# EAGLE design main (EAGLE 9.3.0)
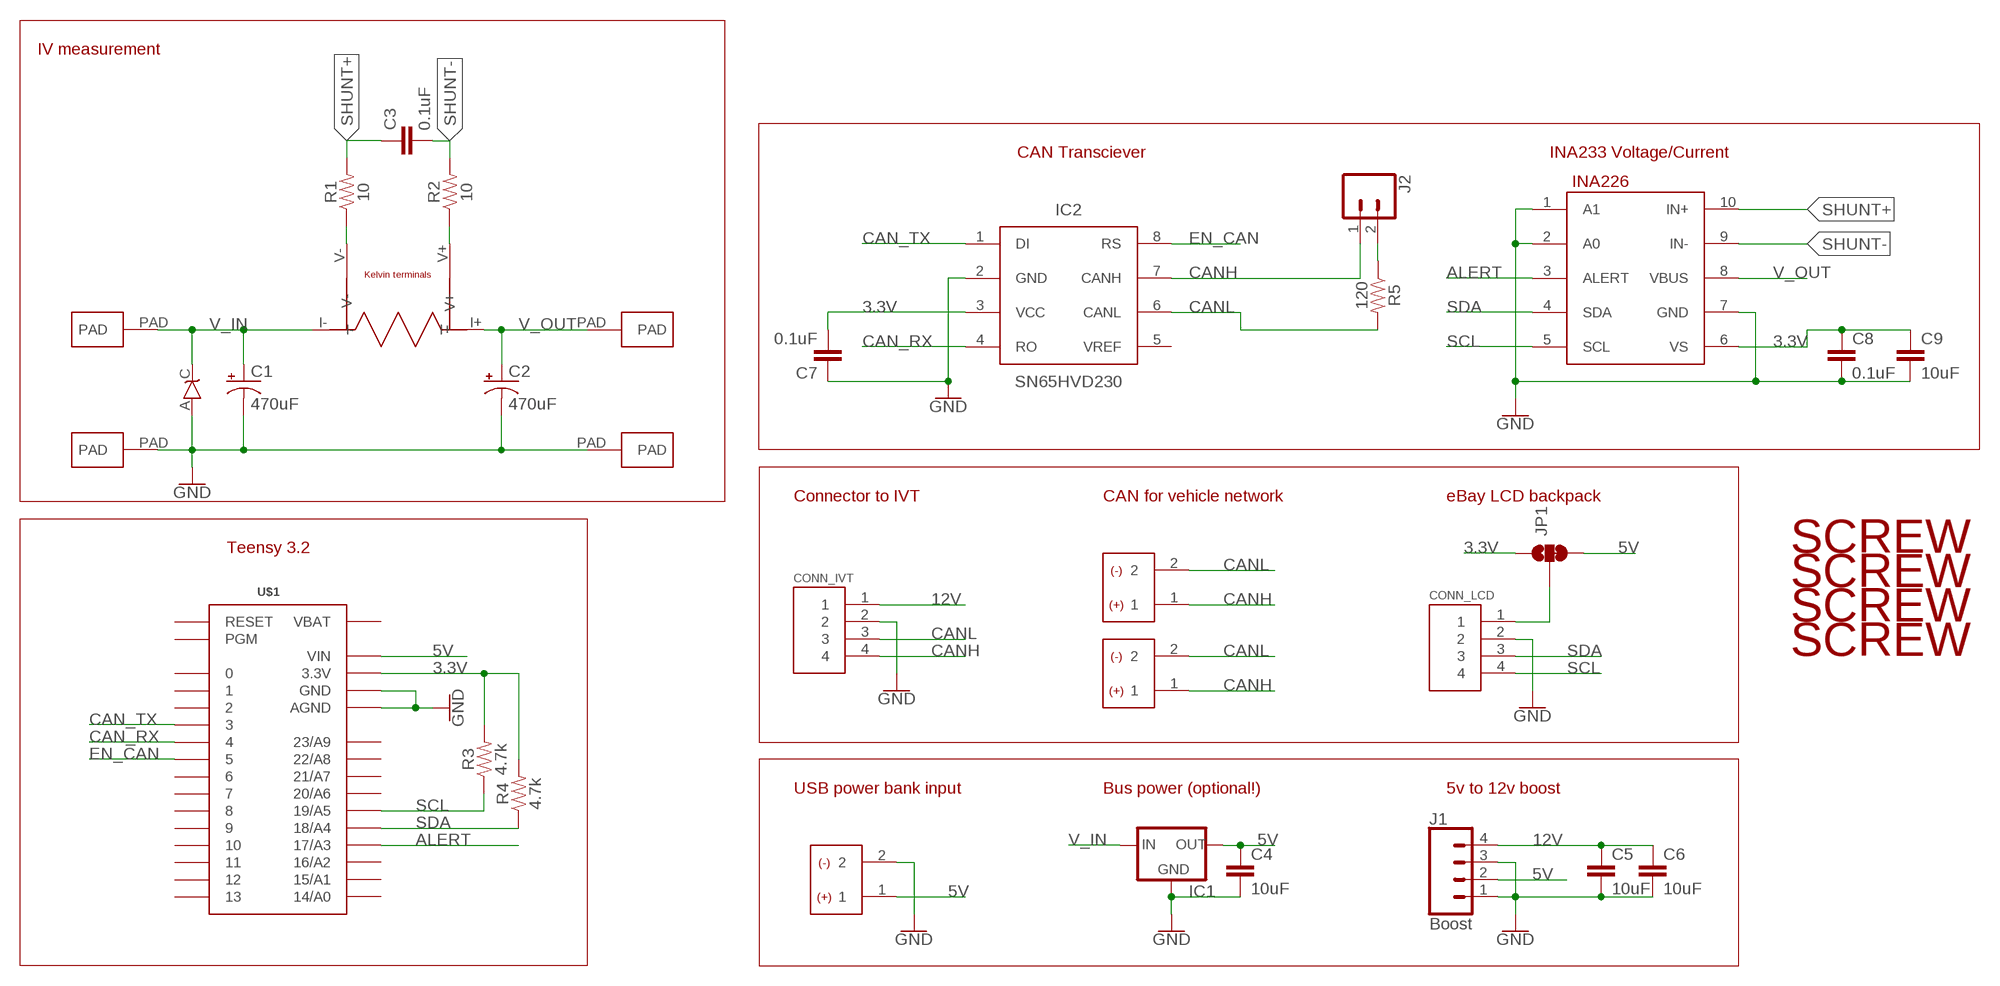
[diagram p0: schematic, sheet 1]

## Parts
C1  470uF  1000UF-RADIAL-5MM-25V-20%  [CPOL-RADIAL-5MM-10MM]
C2  470uF  1000UF-RADIAL-5MM-25V-20%  [CPOL-RADIAL-5MM-10MM]
C3  0.1uF  0.1UF-0603-25V-5%  [0603]
C4  10uF  10UF-1210-50V-20%  [1210]
C5  10uF  10UF-1210-50V-20%  [1210]
C6  10uF  10UF-1210-50V-20%  [1210]
C7  0.1uF  0.1UF-0603-25V-5%  [0603]
C8  0.1uF  0.1UF-0603-25V-5%  [0603]
C9  10uF  10UF-1210-50V-20%  [1210]
CONN_IVT  LCD  HEADER4VALULOK  [4PINVALULOK]
CONN_LCD  LCD  HEADER4VALULOK  [4PINVALULOK]
IC1  V_REG_78XX  [V78W_BACKWARDS]
IC2  SN65HVD230  SN65HVD230SOIC-8  [SOIC127P650X175-8]
J1  Boost  CONN_04LONGPADS  [1X04_LONGPADS]
J2  CONN_02  [1X02]
JP1  JUMPER-SMT_3_1-NC_TRACE_SILK  [SMT-JUMPER_3_1-NC_TRACE_SILK]
R1  10  RESISTOR0603  [0603]
R2  10  RESISTOR0603  [0603]
R3  4.7k  RESISTOR0603  [0603]
R4  4.7k  RESISTOR0603  [0603]
R5  120  RESISTOR0603  [0603]
U$1  TEENSY_3.0_BASIC  [TEENSY_3.0_BASIC]
U$2  5mOhm  SHUNT_KELVIN  [2512_KELVIN]
U$3  PAD  [PAD]
U$4  PAD  [PAD]
U$5  INA226  [PSOP-10]
U$6  TVS_UNIDO-214AC  [DO-214AC]
U$7  PAD  [PAD]
U$8  PAD  [PAD]
U$9  HEADER2  [2PINVALULOK]
U$10  HEADER2  [2PINVALULOK]
U$11  SCREW  [M3HOLE]
U$12  SCREW  [M3HOLE]
U$13  SCREW  [M3HOLE]
U$14  SCREW  [M3HOLE]
USB_PWR  USB_PWR  HEADER2  [2PINVALULOK]

## Nets
3.3V: C7.2 C8.1 C9.1 IC2.3(VCC) JP1.1 R3.2 R4.2 U$1.3.3V U$1.3.3V1(3.3V) U$5.6(VS)
5V: C4.1 IC1.OUT J1.2 JP1.3 U$1.VIN USB_PWR.1
12V: C5.1 C6.1 CONN_IVT.1 J1.4
ALERT: U$1.17/A3 U$5.3(ALERT)
CAN_RX: IC2.4(RO) U$1.4
CAN_TX: IC2.1(DI) U$1.3
CANH: CONN_IVT.4 IC2.7(CANH) J2.1 U$9.1 U$10.1
CANL: CONN_IVT.3 IC2.6(CANL) R5.2 U$9.2 U$10.2
EN_CAN: IC2.8(RS) U$1.5
GND: C1.- C2.- C4.2 C5.2 C6.2 C7.1 C8.2 C9.2 CONN_IVT.2 CONN_LCD.2 IC1.GND IC2.2(GND) J1.1 J1.3 U$1.AGND U$1.GND U$1.GND1(GND) U$4.PAD U$5.1(A1) U$5.2(A0) U$5.7(GND) U$6.A U$8.PAD USB_PWR.2
N$1: R1.1 U$2.V-
N$2: R2.1 U$2.V+
N$3: CONN_LCD.1 JP1.2
N$4: J2.2 R5.1
SCL: CONN_LCD.4 R3.1 U$1.19/A5 U$5.5(SCL)
SDA: CONN_LCD.3 R4.1 U$1.18/A4 U$5.4(SDA)
SHUNT+: C3.1 R1.2 U$5.10(IN+)
SHUNT-: C3.2 R2.2 U$5.9(IN-)
V_IN: C1.+ IC1.IN U$2.I- U$3.PAD U$6.C
V_OUT: C2.+ U$2.I+ U$5.8(VBUS) U$7.PAD
Unconnected: IC2.5(VREF) U$1.0 U$1.1 U$1.2 U$1.6 U$1.7 U$1.8 U$1.9 U$1.10 U$1.11 U$1.12 U$1.13 U$1.14/A0 U$1.15/A1 U$1.16/A2 U$1.20/A6 U$1.21/A7 U$1.22/A8 U$1.23/A9 U$1.PGM U$1.RESET

## Notes on the sheet
- IV measurement
- CAN Transciever | INA233 Voltage/Current
- Connector to IVT | CAN for vehicle network | eBay LCD backpack
- Teensy 3.2
- USB power bank input | Bus power (optional!) | 5v to 12v boost

## Power pins joined to a net without a drawn wire
VBAT: U$1.VBAT

## Library data of the parts
C1 C2 = SparkFun-Capacitors:1000UF: 1,000µF/1mF ceramic capacitors A capacitor is a passive two-terminal electrical component used to store electrical energy temporarily in an electric field. CAP-08070; PROD_ID: CAP-09538; VALUE: 1mF
C3 C7 C8 = SparkFun-Capacitors:0.1UF: 0.1µF ceramic capacitors A capacitor is a passive two-terminal electrical component used to store electrical energy temporarily in an electric field.; PROD_ID: CAP-08604
C4-C6 C9 = SparkFun-Capacitors:10UF: 10.0µF ceramic capacitors A capacitor is a passive two-terminal electrical component used to store electrical energy temporarily in an electric field.; PROD_ID: CAP-09824
CONN_IVT CONN_LCD = Custom_old:HEADER4
IC1 = 2018:V_REG_78XX: Voltage Regulator Standard 7805 5V regulator. IGO (Input Ground Output). Spark Fun Electronics SKU : COM-00107
IC2 = Custom_new:SN65HVD230
J1 = SparkFun-Connectors:CONN_04: Multi connection point. Often used as Generic Header-pin footprint for 0.1 inch spaced/style header connections On any of the 0.1 inch spaced packages, you can populate with these: Break Away Headers - Straight <https://www.sparkfun.com/products/116> (PRT-00116) Break Away Male Headers - Right Angle <https://www.sparkfun.com/products/553> (PRT-00553) Female Headers <https://www.sparkfun.com/products/115> (PRT-00115) Break Away Headers - Machine Pin <https://www.sparkfun.com/products/117> (PRT-00117) Break Away Female Headers - Swiss Machine Pin <https://www.sparkfun.com/products/743> (PRT-00743) For SCREWTERMINALS and SPRING TERMINALS visit here: Screw Terimnals on SparkFun.com <https://www.sparkfun.com/search/results?term=Screw+Terminals> (5mm/3.5mm/2.54mm spacing) This device is also useful as a general connection point to wire up your design to another part of your project. Our various solder wires solder well into these plated through hole pads. Hook-Up Wire - Assortment (Stranded, 22 AWG) <https://www.sparkfun.com/products/11375> (PRT-11375) Hook-Up Wire - Assortment (Solid Core, 22 AWG) <https://www.sparkfun.com/products/11367> (PRT-11367) View the entire wire category on our website here <https://www.sparkfun.com/categories/141> Special notes: Molex polarized connector foot print use with SKU : PRT-08231 with associated crimp pins and housings. 1MM SMD Version SKU: PRT-10208; PROD_ID: CONN-09696
J2 = SparkFun-Connectors:CONN_02: Multi connection point. Often used as Generic Header-pin footprint for 0.1 inch spaced/style header connections On any of the 0.1 inch spaced packages, you can populate with these: Break Away Headers - Straight <https://www.sparkfun.com/products/116> (PRT-00116) Break Away Male Headers - Right Angle <https://www.sparkfun.com/products/553> (PRT-00553) Female Headers <https://www.sparkfun.com/products/115> (PRT-00115) Break Away Headers - Machine Pin <https://www.sparkfun.com/products/117> (PRT-00117) Break Away Female Headers - Swiss Machine Pin <https://www.sparkfun.com/products/743> (PRT-00743) For SCREWTERMINALS and SPRING TERMINALS visit here: Screw Terimnals on SparkFun.com <https://www.sparkfun.com/search/results?term=Screw+Terminals> (5mm/3.5mm/2.54mm spacing) This device is also useful as a general connection point to wire up your design to another part of your project. Our various solder wires solder well into these plated through hole pads. Hook-Up Wire - Assortment (Stranded, 22 AWG) <https://www.sparkfun.com/products/11375> (PRT-11375) Hook-Up Wire - Assortment (Solid Core, 22 AWG) <https://www.sparkfun.com/products/11367> (PRT-11367) View the entire wire category on our website here <https://www.sparkfun.com/categories/141> Special notes: Molex polarized connector foot print use with: PRT-08233 with associated crimp pins and housings. 2.54_SCREWTERM for use with PRT-10571. 3.5mm Screw Terminal footprints for PRT-08084 5mm Screw Terminal footprints for use with PRT-08432
JP1 = SparkFun-Jumpers:JUMPER-SMT_3_1-NC_TRACE: Normally closed trace jumper (1 of 2 connections) This jumper has a trace between two pads so it's normally closed (NC). The other connection is normally open (NO). Use a razor knife to open the connection. For best results follow the IPC guidelines for cutting traces: Cutout at least 0.063 mm (0.005 in). Remove all loose material to clean up the cut area. Seal the cut with an approved epoxy. Reapply solder to reclose the connection, or to close the NO connection.
R1-R5 = SparkFun-Resistors:RESISTOR: Generic Resistor Package
U$1 = Teensy3.0:TEENSY_3.0_BASIC: Basic Teensy 3.0 with none of the 'inner' pins enabled. See '+4', 'AllAnalogPins", and 'AllPins' packages for additional pin holes, as needed.
U$2 = 2018:SHUNT_KELVIN
U$3 U$4 U$7 U$8 = Custom_old:PAD
U$5 = 2018:INA226
U$6 = 2018:TVS_UNI
U$9 U$10 USB_PWR = Custom_old:HEADER2
U$11-U$14 = Custom_old:SCREW

## Board
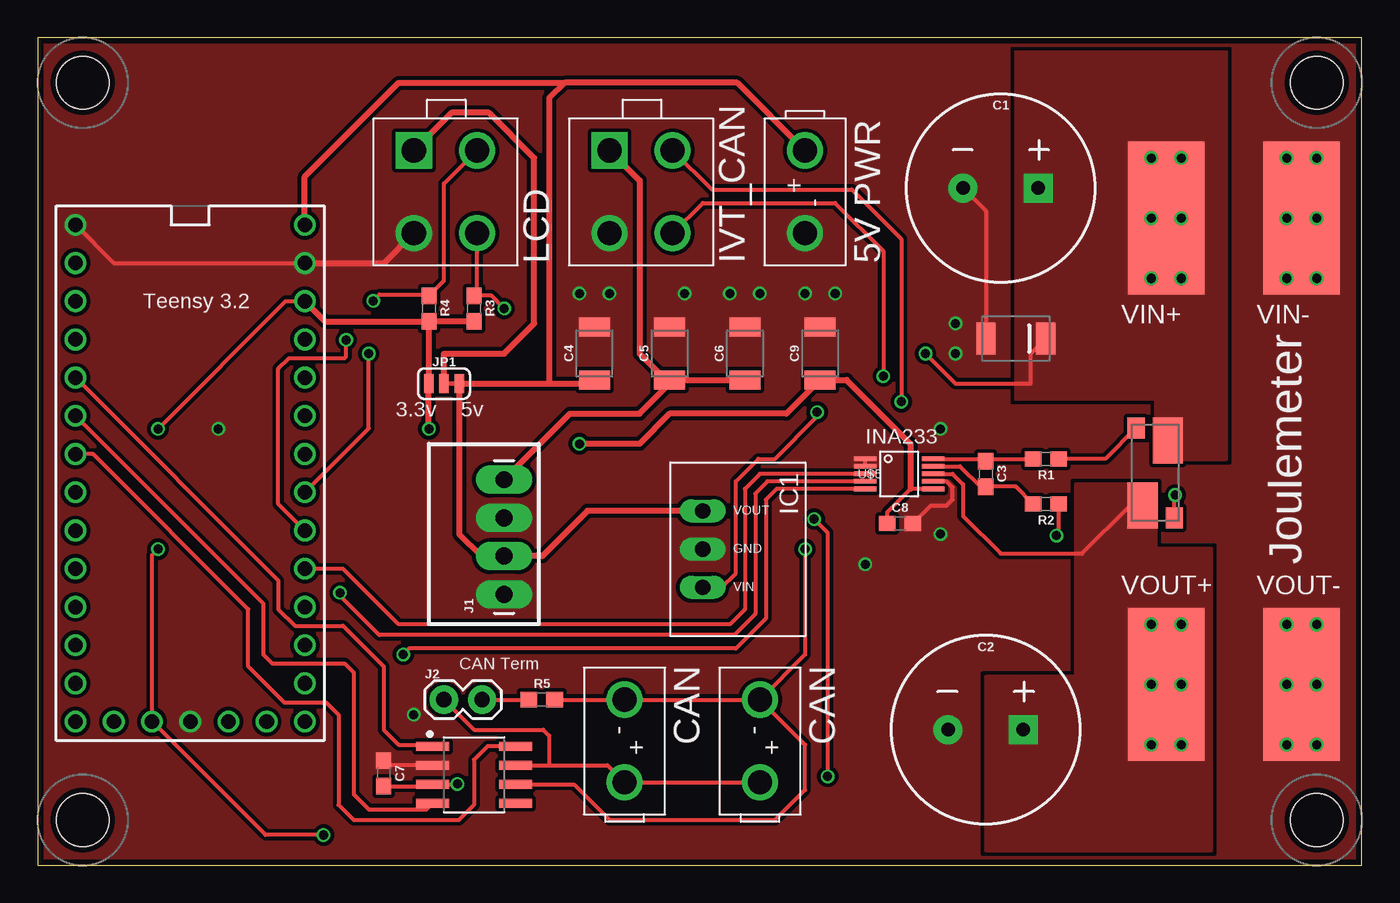
[diagram p1: board, top side]
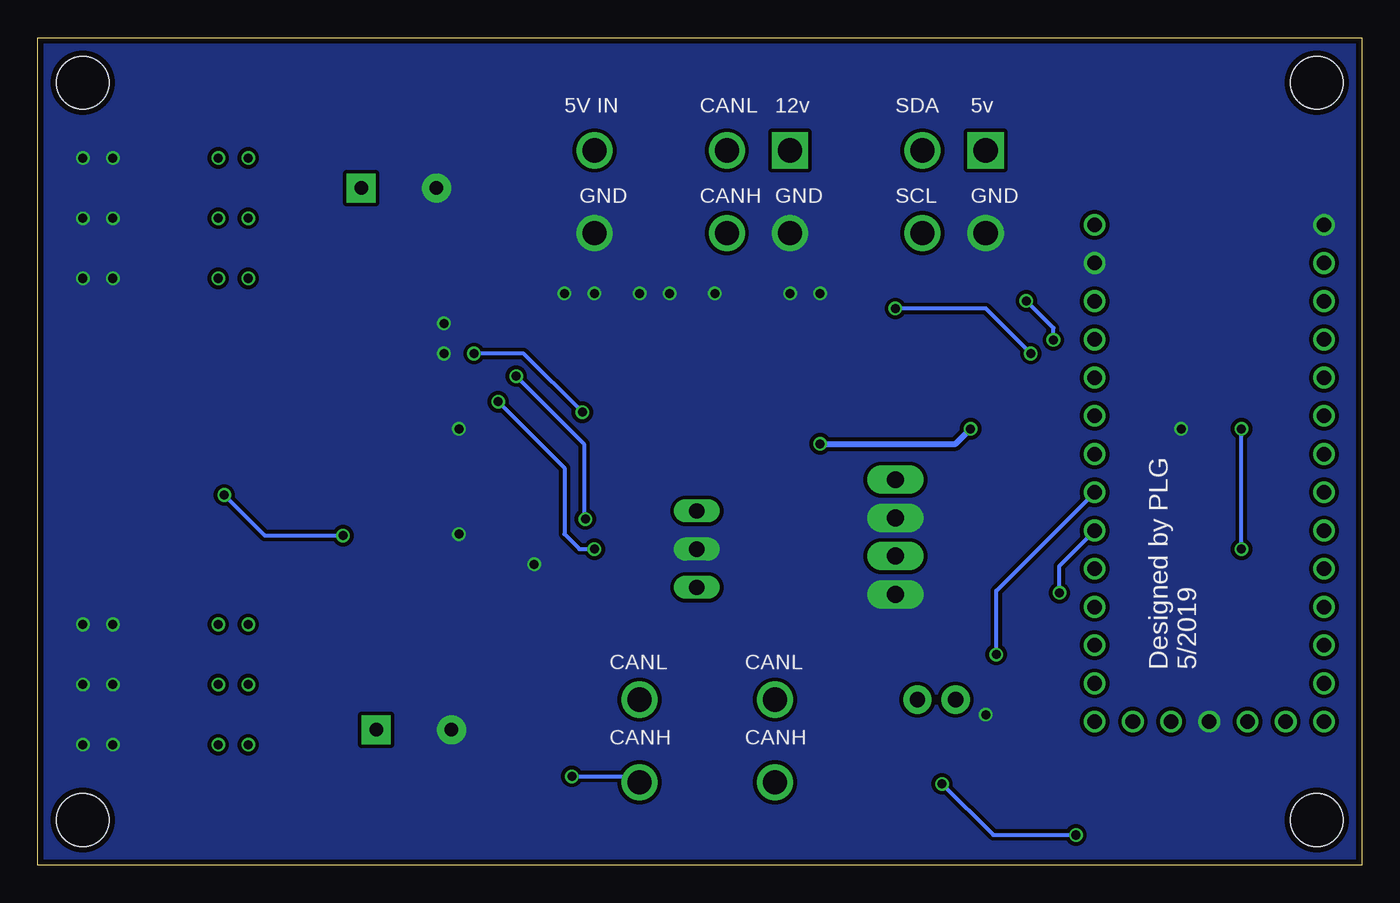
[diagram p2: board, bottom side, seen from below]

Size 88 x 55 mm. Coordinates in mm from the lower left corner, seen from the top.
Outline: 0,0 88,0 88,55 0,55 0,0
Copper layers (1*16): Top 0.035559375mm / dielectric 1.6mm / Bottom 0.035559375mm
Design rules "PATRICK-2lyr": minimum track width 6mil, minimum drill 10mil, track to track 6mil, track to pad 6mil, pad to pad 6mil, via to via 6mil, smd to smd 6mil, copper to edge 15mil, drill to drill 6mil, minimum pad ring 5mil, minimum via ring 5mil, stop-mask expansion 2.5mil, vias tented up to drill 25mil, thermal gap 10mil

### Footprints (pad centres in the part's own frame; a part is rotated, then mirrored left to right if it is on the bottom)
CPOL-RADIAL-5MM-10MM = drill 0.9 pad 1.93 square: + 2.5,0 | drill 0.9 pad 1.93: - -2.5,0
0603 = smd 1.1 x 1: 1 -0.85,0; 2 0.85,0
1210 = smd 1.27 x 2.06: 1 -1.755,0; 2 1.755,0
4PINVALULOK = drill 1.6 square: 1 0,5.5 | drill 1.6: 2 0,0; 3 4.2,5.5; 4 4.2,0
V78W_BACKWARDS = drill 1.016 long: GND 0,-3.81; IN 2.54,-3.81; OUT -2.54,-3.81
SOIC127P650X175-8 = smd 2.187 x 0.602: 1 -2.76,1.905; 2 -2.76,0.635; 3 -2.76,-0.635; 4 -2.76,-1.905; 5 2.76,-1.905; 6 2.76,-0.635; 7 2.76,0.635; 8 2.76,1.905
1X04_LONGPADS = drill 1.118 pad 1.88 long: 1 0,0; 2 2.54,0; 3 5.08,0; 4 7.62,0
1X02 = drill 1.016 pad 1.88: 1 0,0; 2 2.54,0
SMT-JUMPER_3_1-NC_TRACE_SILK = smd 0.635 x 1.27: 1 -1.016,0; 2 0,0; 3 1.016,0
TEENSY_3.0_BASIC = drill 0.965: 0 -7.62,13.97; 1 -7.62,11.43; 2 -7.62,8.89; 3 -7.62,6.35; 3.3V 7.62,11.43; 3.3V1 -2.54,-16.51; 4 -7.62,3.81; 5 -7.62,1.27; 6 -7.62,-1.27; 7 -7.62,-3.81; 8 -7.62,-6.35; 9 -7.62,-8.89; 10 -7.62,-11.43; 11 -7.62,-13.97; 12 -7.62,-16.51; 13 7.62,-16.51; 14/A0 7.62,-13.97; 15/A1 7.62,-11.43; 16/A2 7.62,-8.89; 17/A3 7.62,-6.35; 18/A4 7.62,-3.81; 19/A5 7.62,-1.27; 20/A6 7.62,1.27; 21/A7 7.62,3.81; 22/A8 7.62,6.35; 23/A9 7.62,8.89; AGND 7.62,13.97; GND -7.62,16.51; GND1 0,-16.51; PGM 2.54,-16.51; RESET 5.08,-16.51; VBAT -5.08,-16.51; VIN 7.62,16.51
2512_KELVIN = smd 3.048 x 2.007: I+ 5.842,1.003; I- 1.524,2.68 | smd 1.397 x 1.143: V+ 6.668,3.111; V- 0.699,0.572
PAD = smd 10.16 x 5.08: PAD 0,0
PSOP-10 = smd 1.5 x 0.3: 1 0,1; 2 0,0.5; 3 0,0; 4 0,-0.5; 5 0,-1; 6 4.5,-1; 7 4.5,-0.5; 8 4.5,0; 9 4.5,0.5; 10 4.5,1
DO-214AC = smd 1.27 x 2.1: A 1.985,0; C -1.985,0
2PINVALULOK = drill 1.6: 1 0,5.5; 2 0,0
M3HOLE = hole 3.5: 0,0

### Placement (x,y rotation side)
C1  64,45 0 top
C2  63,9 0 top
C3  63,26 270 top
C4  37,34 90 top
C5  42,34 90 top
C6  47,34 90 top
C7  23,6.1 270 top
C8  57.3,22.7 0 top
C9  52,34 90 top
CONN_IVT  38,42 0 top
CONN_LCD  25,42 0 top
IC1  48,21 270 top
IC2  29,6 0 top
J1  31,18 90 top
J2  27,11 0 top
JP1  27,32 0 top
R1  67,27 180 top
R2  67,24 180 top
R3  29,37 270 top
R4  26,37 270 top
R5  33.5,11 0 top
U$1  10.14,26.05 0 top
U$2  72.42,29.75 270 top
U$3  75,43 90 top
U$4  84,43 90 top
U$5  55,26 0 top
U$6  65,35 180 top
U$7  75,12 90 top
U$8  84,12 90 top
U$9  48,11 180 top
U$10  39,11 180 top
U$11  3,3 0 top
U$12  3,52 0 top
U$13  85,52 0 top
U$14  85,3 0 top
USB_PWR  51,42 0 top

### Tracks (layer width: path | path; a pad name or v marks a point on that pad's centre or on a via)
3.3V  (via drill 0.6)
  Top 0.254: C7.2 26.12,5.25 IC2.3 27.73,5.37 27.8,5.3 v27.9,5.4 | v8,21 7.6,20.6 U$1.3.3V1 15.14,2 v19,2 | v8,29 16.48,37.48 U$1.3.3V | 25.98,36.13 R4.2 | U$5.6 58,25 56.45,23.45 C8.1
  Top 0.406: U$1.3.3V 19.11,36.13 25.98,36.13 | R3.2 R4.2 26,32.02 JP1.1 25.98,29.02 v26,29 | v36,28 40,28 42,30 49.76,30 C9.1 53.76,32.24 58,28 58,25
  Bottom 0.254: v8,21 v8,29 | v27.9,5.4 24.5,2 v19,2
  Bottom 0.406: v36,28 27,28 v26,29
5V
  Top 0.406: 34,32 JP1.3 28.02,21.98 29.46,20.54 J1.2 33.54,20.54 36.54,23.54 IC1.OUT | 34,32 36.76,32 C4.1 | USB_PWR.1 46.5,52 35,52 | 35,52 34,51 34,32 | U$1.VIN 17.76,45.76 24,52 35,52
12V
  Top 0.406: C6.1 C5.1 42,32 | J1.4 35.38,30 40,30 42,32 | CONN_IVT.1 40,45.5 40,34 42,32
ALERT
  Top 0.254: U$5.3 48,26 47,25 47,17 46,16 24,16 20.3,19.7 U$1.17/A3
CAN_RX
  Top 0.254: U$1.4 15,17.38 15,14 15.6,13.4 20.4,13.4 21,12.8 21,4.7 22,3.7 25.84,3.7 IC2.4
CAN_TX
  Top 0.254: U$1.3 16,18.92 16,17 17.1,15.9 20.3,15.9 23,13.2 23,9 24,8 26.34,8 IC2.1
CANH  (via drill 0.6)
  Top 0.254: IC2.7 34,6.63 | 34,6.63 37.87,6.63 U$10.1 U$9.1 | CONN_IVT.4 44.2,44 53,44 56.2,40.8 v56.2,32.5 | v51.6,23 52.5,22.1 v52.5,5.9 | J2.1 29,9 33.6,9 34,8.6 34,6.63
  Bottom 0.254: v56.2,32.5 51.7,28 51.7,23 v51.6,23 | v52.5,5.9 48.4,5.9 U$9.1
CANL  (via drill 0.6)
  Top 0.254: U$9.2 U$10.2 R5.2 | IC2.6 35.63,5.37 38,3 49,3 51,5 51,8 U$9.2 | CONN_IVT.3 44.8,44.9 54.1,44.9 57.4,41.6 v57.4,30.8 | v51,21 51,14 U$9.2
  Bottom 0.254: v57.4,30.8 53,26.4 53,22 52,21 v51,21
EN_CAN
  Top 0.254: IC2.8 29.91,7.91 29,7 29,4 28,3 21,3 20,4 20,10 19.2,10.8 16.4,10.8 14,13.2 14,17 3.68,27.32 U$1.5
GND  (via drill 0.6)
  Top 0.254: IC2.2 23.32,6.63 C7.1 | U$1.GND 5.06,40.02 U$1.AGND | C8.2 59.35,23.9 60.4,23.9 60.8,24.3 60.8,25.1 60.4,25.5 U$5.7 | C1.- 63.02,43.48 U$6.A | U$5.2 U$5.1
  Top 0.406: U$1.AGND 23.02,40.02 CONN_LCD.2
  other vias: 83,47 85,47 85,43 83,43 85,39 83,39 83,8 85,8 85,12 83,12 83,16 85,16 60,22 55,20 61,36 61,34 60,29 36,38 38,38 43,38 46,38 48,38 51,38 53,38 25,10 12,29
  pour Bottom (isolate 0.254, rank 6, no thermals): -1,56 -1,-1 89,-1 89,56
  pour Top (isolate 0.254, rank 6, no thermals): -2,57 -2,-2 90,-2 90,57
N$1
  Top 0.254: U$2.V- 70.94,27 R1.1
N$2  (via drill 0.6)
  Top 0.254: U$2.V+ 75.53,24.53 v75.6,24.6 | v67.7,21.9 67.85,22.05 R2.1
  Bottom 0.254: v75.6,24.6 72.9,21.9 v67.7,21.9
N$3
  Top 0.406: JP1.2 27,34 31,34 33,36 33,47 30,50 27.5,50 CONN_LCD.1
N$4
  Top 0.254: J2.2 R5.1
SCL  (via drill 0.6)
  Top 0.254: CONN_LCD.4 29.2,38.05 R3.1 30.15,37.85 v31,37 | U$1.19/A5 22,29.02 v22,34 | U$5.5 49.1,25 48.4,24.3 48.4,16.4 46.4,14.4 24.7,14.4 v24.3,14
  Bottom 0.254: v22,34 25,37 v31,37 | v24.3,14 24.3,18.24 U$1.19/A5
SDA  (via drill 0.6)
  Top 0.254: R4.1 26.07,37.92 | 26.07,37.92 27,38.85 27,45.3 CONN_LCD.3 | U$1.18/A4 16,24 16,33 16.7,33.7 20.4,33.7 20.5,33.8 v20.5,34.9 | v22.3,37.5 22.73,37.92 26.07,37.92 | U$5.4 48.5,25.5 47.7,24.7 47.7,16.7 46.3,15.3 22.7,15.3 20,18 v20.1,18.1
  Bottom 0.254: v20.5,34.9 20.5,35.7 v22.3,37.5 | v20.1,18.1 20.1,19.9 U$1.18/A4
SHUNT+
  Top 0.254: R1.2 63.15,27 C3.1 62.85,27 U$5.10
SHUNT-
  Top 0.254: R2.2 65,25.15 C3.2 62.65,25.15 61.3,26.5 U$5.9
V_IN  (via drill 0.6)
  Top 0.254: IC1.IN 45.46,18.46 46.4,19.4 46.4,25.5 47.9,27 49,27 51.8,29.8 v51.8,30.1 | v59,34 61,32 66,32 66,34.02 U$6.C
  Bottom 0.254: v51.8,30.1 55.7,34 v59,34
  other vias: 76,39 74,39 74,43 76,43 76,47 74,47
  pour Top (no thermals): 65,54 65,31 68,31 74.3,31 74.3,27 79,27 79,54
V_OUT  (via drill 0.6)
  Top 0.254: U$5.8 60.8,26 61.5,25.3 61.5,23.2 64,20.7 69.4,20.7 72.61,23.91 U$2.I+
  other vias: 76,16 76,12 76,8 74,8 74,12 74,16
  pour Top (no thermals): 74.3,25.3 69,25.3 69,12.5 63,12.5 63,1 78,1 78,21 74.3,21

### Text on the board
tPlace: LCD | IVT_CAN | 5V PWR | Teensy 3.2 | VIN+ | VIN- | 3.3v 5v | INA233 | Joulemeter | VOUT+ | VOUT- | CAN Term | CAN | CAN
bPlace: 5v | SDA | 12v | CANL | 5V IN | GND | SCL | GND | CANH | GND | Designed by PLG / 5/2019 | CANL | CANL | CANH | CANH